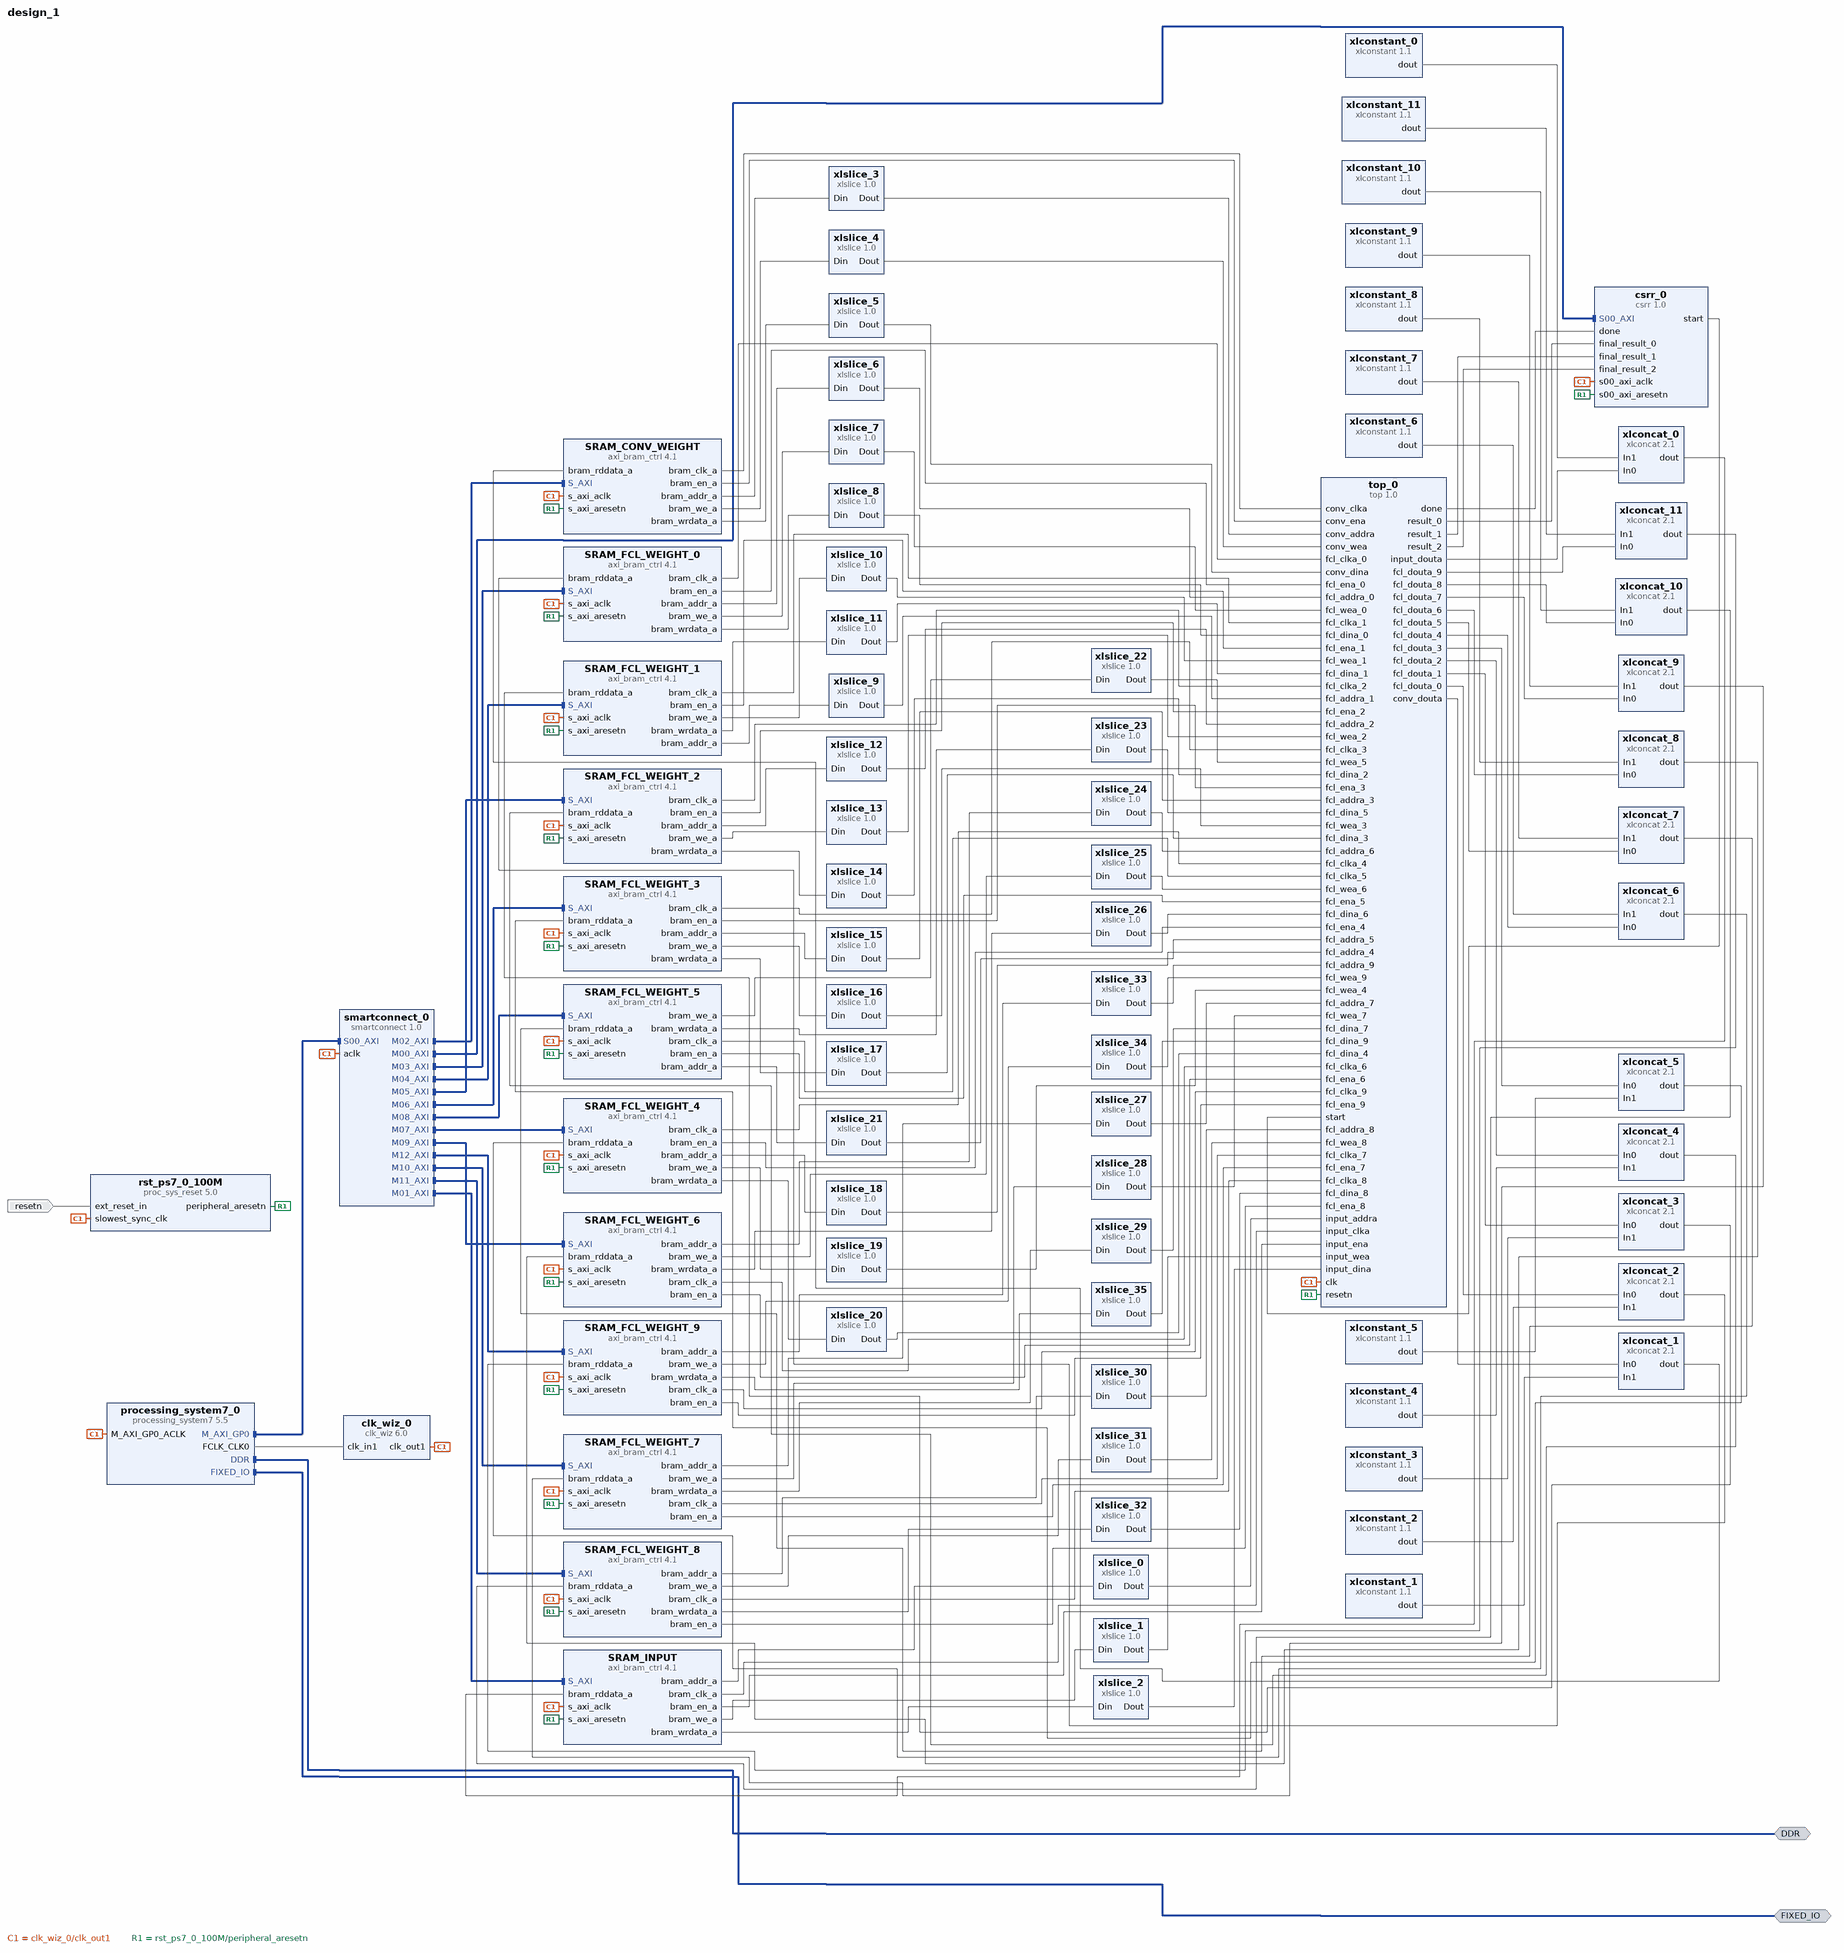
[diagram p0: block diagram of the top level]
# Vivado block design design_1, xc7z020clg400-1, Vivado 2021.1
create_bd_design design_1

create_bd_intf_port -mode Master -vlnv xilinx.com:interface:ddrx_rtl:1.0 DDR
create_bd_intf_port -mode Master -vlnv xilinx.com:display_processing_system7:fixedio_rtl:1.0 FIXED_IO
create_bd_port -dir I -type rst resetn

create_bd_cell -type ip -vlnv xilinx.com:ip:processing_system7:5.5 processing_system7_0
set_property -dict [list \
  CONFIG.PCW_APU_PERIPHERAL_FREQMHZ 650 \
  CONFIG.PCW_CRYSTAL_PERIPHERAL_FREQMHZ 50 \
  CONFIG.PCW_ENET0_ENET0_IO {MIO 16 .. 27} \
  CONFIG.PCW_ENET0_GRP_MDIO_ENABLE 1 \
  CONFIG.PCW_ENET0_GRP_MDIO_IO {MIO 52 .. 53} \
  CONFIG.PCW_ENET0_PERIPHERAL_ENABLE 1 \
  CONFIG.PCW_ENET0_RESET_ENABLE 1 \
  CONFIG.PCW_ENET0_RESET_IO {MIO 9} \
  CONFIG.PCW_ENET_RESET_ENABLE 1 \
  CONFIG.PCW_ENET_RESET_SELECT {Share reset pin} \
  CONFIG.PCW_FPGA0_PERIPHERAL_FREQMHZ 100 \
  CONFIG.PCW_FPGA1_PERIPHERAL_FREQMHZ 50 \
  CONFIG.PCW_GPIO_MIO_GPIO_ENABLE 1 \
  CONFIG.PCW_GPIO_MIO_GPIO_IO MIO \
  CONFIG.PCW_I2C_RESET_ENABLE 1 \
  CONFIG.PCW_M_AXI_GP0_FREQMHZ 10 \
  CONFIG.PCW_PERIPHERAL_BOARD_PRESET None \
  CONFIG.PCW_PRESET_BANK1_VOLTAGE {LVCMOS 1.8V} \
  CONFIG.PCW_QSPI_GRP_FBCLK_ENABLE 1 \
  CONFIG.PCW_QSPI_GRP_FBCLK_IO {MIO 8} \
  CONFIG.PCW_QSPI_GRP_SINGLE_SS_ENABLE 1 \
  CONFIG.PCW_QSPI_GRP_SINGLE_SS_IO {MIO 1 .. 6} \
  CONFIG.PCW_QSPI_PERIPHERAL_ENABLE 1 \
  CONFIG.PCW_QSPI_QSPI_IO {MIO 1 .. 6} \
  CONFIG.PCW_SD0_GRP_CD_ENABLE 1 \
  CONFIG.PCW_SD0_GRP_CD_IO {MIO 47} \
  CONFIG.PCW_SD0_GRP_WP_ENABLE 0 \
  CONFIG.PCW_SD0_PERIPHERAL_ENABLE 1 \
  CONFIG.PCW_SD0_SD0_IO {MIO 40 .. 45} \
  CONFIG.PCW_SDIO_PERIPHERAL_FREQMHZ 50 \
  CONFIG.PCW_SINGLE_QSPI_DATA_MODE x4 \
  CONFIG.PCW_UART0_PERIPHERAL_ENABLE 1 \
  CONFIG.PCW_UART0_UART0_IO {MIO 14 .. 15} \
  CONFIG.PCW_UART1_PERIPHERAL_ENABLE 0 \
  CONFIG.PCW_UART_PERIPHERAL_FREQMHZ 100 \
  CONFIG.PCW_UIPARAM_DDR_BUS_WIDTH {16 Bit} \
  CONFIG.PCW_UIPARAM_DDR_FREQ_MHZ 525 \
  CONFIG.PCW_UIPARAM_DDR_PARTNO {MT41J256M16 RE-125} \
  CONFIG.PCW_USB0_PERIPHERAL_ENABLE 1 \
  CONFIG.PCW_USB0_RESET_ENABLE 1 \
  CONFIG.PCW_USB0_RESET_IO {MIO 46} \
  CONFIG.PCW_USB0_USB0_IO {MIO 28 .. 39} \
  CONFIG.PCW_USB_RESET_ENABLE 1 \
  CONFIG.PCW_USB_RESET_SELECT {Share reset pin} \
] [get_bd_cells processing_system7_0]
# 481 more settings of processing_system7_0 are not shown: defaults, MIO pin electricals, DDR timing, and values the tool derives
create_bd_cell -type ip -vlnv xilinx.com:ip:axi_bram_ctrl:4.1 SRAM_INPUT
set_property -dict {CONFIG.SINGLE_PORT_BRAM 1} [get_bd_cells SRAM_INPUT]
create_bd_cell -type ip -vlnv xilinx.com:ip:axi_bram_ctrl:4.1 SRAM_CONV_WEIGHT
set_property -dict {CONFIG.SINGLE_PORT_BRAM 1} [get_bd_cells SRAM_CONV_WEIGHT]
create_bd_cell -type ip -vlnv xilinx.com:ip:axi_bram_ctrl:4.1 SRAM_FCL_WEIGHT_0
set_property -dict {CONFIG.SINGLE_PORT_BRAM 1} [get_bd_cells SRAM_FCL_WEIGHT_0]
create_bd_cell -type ip -vlnv xilinx.com:ip:xlslice:1.0 xlslice_0
set_property -dict {CONFIG.DIN_FROM 13 CONFIG.DIN_TO 2 CONFIG.DIN_WIDTH 14 CONFIG.DOUT_WIDTH 12} [get_bd_cells xlslice_0]
create_bd_cell -type ip -vlnv xilinx.com:ip:xlslice:1.0 xlslice_1
set_property -dict {CONFIG.DIN_WIDTH 4} [get_bd_cells xlslice_1]
create_bd_cell -type ip -vlnv xilinx.com:ip:xlslice:1.0 xlslice_2
set_property -dict {CONFIG.DIN_FROM 7 CONFIG.DOUT_WIDTH 8} [get_bd_cells xlslice_2]
create_bd_cell -type ip -vlnv xilinx.com:ip:xlslice:1.0 xlslice_3
set_property -dict {CONFIG.DIN_FROM 12 CONFIG.DIN_TO 2 CONFIG.DIN_WIDTH 13 CONFIG.DOUT_WIDTH 11} [get_bd_cells xlslice_3]
create_bd_cell -type ip -vlnv xilinx.com:ip:xlslice:1.0 xlslice_4
set_property -dict {CONFIG.DIN_WIDTH 4} [get_bd_cells xlslice_4]
create_bd_cell -type ip -vlnv xilinx.com:ip:xlslice:1.0 xlslice_5
set_property -dict {CONFIG.DIN_FROM 7 CONFIG.DOUT_WIDTH 8} [get_bd_cells xlslice_5]
create_bd_cell -type ip -vlnv xilinx.com:ip:xlslice:1.0 xlslice_6
set_property -dict {CONFIG.DIN_FROM 13 CONFIG.DIN_TO 2 CONFIG.DIN_WIDTH 14 CONFIG.DOUT_WIDTH 12} [get_bd_cells xlslice_6]
create_bd_cell -type ip -vlnv xilinx.com:ip:xlslice:1.0 xlslice_7
set_property -dict {CONFIG.DIN_WIDTH 4} [get_bd_cells xlslice_7]
create_bd_cell -type ip -vlnv xilinx.com:ip:xlslice:1.0 xlslice_8
set_property -dict {CONFIG.DIN_FROM 7 CONFIG.DOUT_WIDTH 8} [get_bd_cells xlslice_8]
create_bd_cell -type ip -vlnv xilinx.com:ip:axi_bram_ctrl:4.1 SRAM_FCL_WEIGHT_1
set_property -dict {CONFIG.SINGLE_PORT_BRAM 1} [get_bd_cells SRAM_FCL_WEIGHT_1]
create_bd_cell -type ip -vlnv xilinx.com:ip:xlslice:1.0 xlslice_9
set_property -dict {CONFIG.DIN_FROM 13 CONFIG.DIN_TO 2 CONFIG.DIN_WIDTH 14 CONFIG.DOUT_WIDTH 12} [get_bd_cells xlslice_9]
create_bd_cell -type ip -vlnv xilinx.com:ip:xlslice:1.0 xlslice_10
set_property -dict {CONFIG.DIN_WIDTH 4} [get_bd_cells xlslice_10]
create_bd_cell -type ip -vlnv xilinx.com:ip:xlslice:1.0 xlslice_11
set_property -dict {CONFIG.DIN_FROM 7 CONFIG.DOUT_WIDTH 8} [get_bd_cells xlslice_11]
create_bd_cell -type ip -vlnv xilinx.com:ip:axi_bram_ctrl:4.1 SRAM_FCL_WEIGHT_2
set_property -dict {CONFIG.SINGLE_PORT_BRAM 1} [get_bd_cells SRAM_FCL_WEIGHT_2]
create_bd_cell -type ip -vlnv xilinx.com:ip:xlslice:1.0 xlslice_12
set_property -dict {CONFIG.DIN_FROM 13 CONFIG.DIN_TO 2 CONFIG.DIN_WIDTH 14 CONFIG.DOUT_WIDTH 12} [get_bd_cells xlslice_12]
create_bd_cell -type ip -vlnv xilinx.com:ip:xlslice:1.0 xlslice_13
set_property -dict {CONFIG.DIN_WIDTH 4} [get_bd_cells xlslice_13]
create_bd_cell -type ip -vlnv xilinx.com:ip:xlslice:1.0 xlslice_14
set_property -dict {CONFIG.DIN_FROM 7 CONFIG.DOUT_WIDTH 8} [get_bd_cells xlslice_14]
create_bd_cell -type ip -vlnv xilinx.com:ip:axi_bram_ctrl:4.1 SRAM_FCL_WEIGHT_3
set_property -dict {CONFIG.SINGLE_PORT_BRAM 1} [get_bd_cells SRAM_FCL_WEIGHT_3]
create_bd_cell -type ip -vlnv xilinx.com:ip:xlslice:1.0 xlslice_15
set_property -dict {CONFIG.DIN_FROM 13 CONFIG.DIN_TO 2 CONFIG.DIN_WIDTH 14 CONFIG.DOUT_WIDTH 12} [get_bd_cells xlslice_15]
create_bd_cell -type ip -vlnv xilinx.com:ip:xlslice:1.0 xlslice_16
set_property -dict {CONFIG.DIN_WIDTH 4} [get_bd_cells xlslice_16]
create_bd_cell -type ip -vlnv xilinx.com:ip:xlslice:1.0 xlslice_17
set_property -dict {CONFIG.DIN_FROM 7 CONFIG.DOUT_WIDTH 8} [get_bd_cells xlslice_17]
create_bd_cell -type ip -vlnv xilinx.com:ip:axi_bram_ctrl:4.1 SRAM_FCL_WEIGHT_4
set_property -dict {CONFIG.SINGLE_PORT_BRAM 1} [get_bd_cells SRAM_FCL_WEIGHT_4]
create_bd_cell -type ip -vlnv xilinx.com:ip:xlslice:1.0 xlslice_18
set_property -dict {CONFIG.DIN_FROM 13 CONFIG.DIN_TO 2 CONFIG.DIN_WIDTH 14 CONFIG.DOUT_WIDTH 12} [get_bd_cells xlslice_18]
create_bd_cell -type ip -vlnv xilinx.com:ip:xlslice:1.0 xlslice_19
set_property -dict {CONFIG.DIN_WIDTH 4} [get_bd_cells xlslice_19]
create_bd_cell -type ip -vlnv xilinx.com:ip:xlslice:1.0 xlslice_20
set_property -dict {CONFIG.DIN_FROM 7 CONFIG.DOUT_WIDTH 8} [get_bd_cells xlslice_20]
create_bd_cell -type ip -vlnv xilinx.com:ip:axi_bram_ctrl:4.1 SRAM_FCL_WEIGHT_5
set_property -dict {CONFIG.SINGLE_PORT_BRAM 1} [get_bd_cells SRAM_FCL_WEIGHT_5]
create_bd_cell -type ip -vlnv xilinx.com:ip:xlslice:1.0 xlslice_21
set_property -dict {CONFIG.DIN_FROM 13 CONFIG.DIN_TO 2 CONFIG.DIN_WIDTH 14 CONFIG.DOUT_WIDTH 12} [get_bd_cells xlslice_21]
create_bd_cell -type ip -vlnv xilinx.com:ip:xlslice:1.0 xlslice_22
set_property -dict {CONFIG.DIN_WIDTH 4} [get_bd_cells xlslice_22]
create_bd_cell -type ip -vlnv xilinx.com:ip:xlslice:1.0 xlslice_23
set_property -dict {CONFIG.DIN_FROM 7 CONFIG.DOUT_WIDTH 8} [get_bd_cells xlslice_23]
create_bd_cell -type ip -vlnv xilinx.com:ip:axi_bram_ctrl:4.1 SRAM_FCL_WEIGHT_6
set_property -dict {CONFIG.SINGLE_PORT_BRAM 1} [get_bd_cells SRAM_FCL_WEIGHT_6]
create_bd_cell -type ip -vlnv xilinx.com:ip:xlslice:1.0 xlslice_24
set_property -dict {CONFIG.DIN_FROM 13 CONFIG.DIN_TO 2 CONFIG.DIN_WIDTH 14 CONFIG.DOUT_WIDTH 12} [get_bd_cells xlslice_24]
create_bd_cell -type ip -vlnv xilinx.com:ip:xlslice:1.0 xlslice_25
set_property -dict {CONFIG.DIN_WIDTH 4} [get_bd_cells xlslice_25]
create_bd_cell -type ip -vlnv xilinx.com:ip:xlslice:1.0 xlslice_26
set_property -dict {CONFIG.DIN_FROM 7 CONFIG.DOUT_WIDTH 8} [get_bd_cells xlslice_26]
create_bd_cell -type ip -vlnv xilinx.com:ip:axi_bram_ctrl:4.1 SRAM_FCL_WEIGHT_7
set_property -dict {CONFIG.SINGLE_PORT_BRAM 1} [get_bd_cells SRAM_FCL_WEIGHT_7]
create_bd_cell -type ip -vlnv xilinx.com:ip:xlslice:1.0 xlslice_27
set_property -dict {CONFIG.DIN_FROM 13 CONFIG.DIN_TO 2 CONFIG.DIN_WIDTH 14 CONFIG.DOUT_WIDTH 12} [get_bd_cells xlslice_27]
create_bd_cell -type ip -vlnv xilinx.com:ip:xlslice:1.0 xlslice_28
set_property -dict {CONFIG.DIN_WIDTH 4} [get_bd_cells xlslice_28]
create_bd_cell -type ip -vlnv xilinx.com:ip:xlslice:1.0 xlslice_29
set_property -dict {CONFIG.DIN_FROM 7 CONFIG.DOUT_WIDTH 8} [get_bd_cells xlslice_29]
create_bd_cell -type ip -vlnv xilinx.com:ip:axi_bram_ctrl:4.1 SRAM_FCL_WEIGHT_8
set_property -dict {CONFIG.SINGLE_PORT_BRAM 1} [get_bd_cells SRAM_FCL_WEIGHT_8]
create_bd_cell -type ip -vlnv xilinx.com:ip:xlslice:1.0 xlslice_30
set_property -dict {CONFIG.DIN_FROM 13 CONFIG.DIN_TO 2 CONFIG.DIN_WIDTH 14 CONFIG.DOUT_WIDTH 12} [get_bd_cells xlslice_30]
create_bd_cell -type ip -vlnv xilinx.com:ip:xlslice:1.0 xlslice_31
set_property -dict {CONFIG.DIN_WIDTH 4} [get_bd_cells xlslice_31]
create_bd_cell -type ip -vlnv xilinx.com:ip:xlslice:1.0 xlslice_32
set_property -dict {CONFIG.DIN_FROM 7 CONFIG.DOUT_WIDTH 8} [get_bd_cells xlslice_32]
create_bd_cell -type ip -vlnv xilinx.com:ip:axi_bram_ctrl:4.1 SRAM_FCL_WEIGHT_9
set_property -dict {CONFIG.SINGLE_PORT_BRAM 1} [get_bd_cells SRAM_FCL_WEIGHT_9]
create_bd_cell -type ip -vlnv xilinx.com:ip:xlslice:1.0 xlslice_33
set_property -dict {CONFIG.DIN_FROM 13 CONFIG.DIN_TO 2 CONFIG.DIN_WIDTH 14 CONFIG.DOUT_WIDTH 12} [get_bd_cells xlslice_33]
create_bd_cell -type ip -vlnv xilinx.com:ip:xlslice:1.0 xlslice_34
set_property -dict {CONFIG.DIN_WIDTH 4} [get_bd_cells xlslice_34]
create_bd_cell -type ip -vlnv xilinx.com:ip:xlslice:1.0 xlslice_35
set_property -dict {CONFIG.DIN_FROM 7 CONFIG.DOUT_WIDTH 8} [get_bd_cells xlslice_35]
create_bd_cell -type ip -vlnv xilinx.com:ip:xlconstant:1.1 xlconstant_0
set_property -dict {CONFIG.CONST_VAL 0 CONFIG.CONST_WIDTH 24} [get_bd_cells xlconstant_0]
create_bd_cell -type ip -vlnv xilinx.com:ip:xlconcat:2.1 xlconcat_0
set_property -dict {CONFIG.IN0_WIDTH 8 CONFIG.IN1_WIDTH 24} [get_bd_cells xlconcat_0]
create_bd_cell -type ip -vlnv xilinx.com:ip:xlconcat:2.1 xlconcat_1
set_property -dict {CONFIG.IN0_WIDTH 8 CONFIG.IN1_WIDTH 24} [get_bd_cells xlconcat_1]
create_bd_cell -type ip -vlnv xilinx.com:ip:xlconstant:1.1 xlconstant_1
set_property -dict {CONFIG.CONST_VAL 0 CONFIG.CONST_WIDTH 24} [get_bd_cells xlconstant_1]
create_bd_cell -type ip -vlnv xilinx.com:ip:xlconcat:2.1 xlconcat_2
set_property -dict {CONFIG.IN0_WIDTH 8 CONFIG.IN1_WIDTH 24} [get_bd_cells xlconcat_2]
create_bd_cell -type ip -vlnv xilinx.com:ip:xlconstant:1.1 xlconstant_2
set_property -dict {CONFIG.CONST_VAL 0 CONFIG.CONST_WIDTH 24} [get_bd_cells xlconstant_2]
create_bd_cell -type ip -vlnv xilinx.com:ip:xlconcat:2.1 xlconcat_3
set_property -dict {CONFIG.IN0_WIDTH 8 CONFIG.IN1_WIDTH 24} [get_bd_cells xlconcat_3]
create_bd_cell -type ip -vlnv xilinx.com:ip:xlconstant:1.1 xlconstant_3
set_property -dict {CONFIG.CONST_VAL 0 CONFIG.CONST_WIDTH 24} [get_bd_cells xlconstant_3]
create_bd_cell -type ip -vlnv xilinx.com:ip:xlconcat:2.1 xlconcat_4
set_property -dict {CONFIG.IN0_WIDTH 8 CONFIG.IN1_WIDTH 24} [get_bd_cells xlconcat_4]
create_bd_cell -type ip -vlnv xilinx.com:ip:xlconstant:1.1 xlconstant_4
set_property -dict {CONFIG.CONST_VAL 0 CONFIG.CONST_WIDTH 24} [get_bd_cells xlconstant_4]
create_bd_cell -type ip -vlnv xilinx.com:ip:xlconcat:2.1 xlconcat_5
set_property -dict {CONFIG.IN0_WIDTH 8 CONFIG.IN1_WIDTH 24} [get_bd_cells xlconcat_5]
create_bd_cell -type ip -vlnv xilinx.com:ip:xlconstant:1.1 xlconstant_5
set_property -dict {CONFIG.CONST_VAL 0 CONFIG.CONST_WIDTH 24} [get_bd_cells xlconstant_5]
create_bd_cell -type ip -vlnv xilinx.com:ip:xlconcat:2.1 xlconcat_6
set_property -dict {CONFIG.IN0_WIDTH 8 CONFIG.IN1_WIDTH 24} [get_bd_cells xlconcat_6]
create_bd_cell -type ip -vlnv xilinx.com:ip:xlconstant:1.1 xlconstant_6
set_property -dict {CONFIG.CONST_VAL 0 CONFIG.CONST_WIDTH 24} [get_bd_cells xlconstant_6]
create_bd_cell -type ip -vlnv xilinx.com:ip:xlconcat:2.1 xlconcat_7
set_property -dict {CONFIG.IN0_WIDTH 8 CONFIG.IN1_WIDTH 24} [get_bd_cells xlconcat_7]
create_bd_cell -type ip -vlnv xilinx.com:ip:xlconstant:1.1 xlconstant_7
set_property -dict {CONFIG.CONST_VAL 0 CONFIG.CONST_WIDTH 24} [get_bd_cells xlconstant_7]
create_bd_cell -type ip -vlnv xilinx.com:ip:xlconcat:2.1 xlconcat_8
set_property -dict {CONFIG.IN0_WIDTH 8 CONFIG.IN1_WIDTH 24} [get_bd_cells xlconcat_8]
create_bd_cell -type ip -vlnv xilinx.com:ip:xlconstant:1.1 xlconstant_8
set_property -dict {CONFIG.CONST_VAL 0 CONFIG.CONST_WIDTH 24} [get_bd_cells xlconstant_8]
create_bd_cell -type ip -vlnv xilinx.com:ip:xlconcat:2.1 xlconcat_9
set_property -dict {CONFIG.IN0_WIDTH 8 CONFIG.IN1_WIDTH 24} [get_bd_cells xlconcat_9]
create_bd_cell -type ip -vlnv xilinx.com:ip:xlconstant:1.1 xlconstant_9
set_property -dict {CONFIG.CONST_VAL 0 CONFIG.CONST_WIDTH 24} [get_bd_cells xlconstant_9]
create_bd_cell -type ip -vlnv xilinx.com:ip:xlconcat:2.1 xlconcat_10
set_property -dict {CONFIG.IN0_WIDTH 8 CONFIG.IN1_WIDTH 24} [get_bd_cells xlconcat_10]
create_bd_cell -type ip -vlnv xilinx.com:ip:xlconstant:1.1 xlconstant_10
set_property -dict {CONFIG.CONST_VAL 0 CONFIG.CONST_WIDTH 24} [get_bd_cells xlconstant_10]
create_bd_cell -type ip -vlnv xilinx.com:ip:xlconcat:2.1 xlconcat_11
set_property -dict {CONFIG.IN0_WIDTH 8 CONFIG.IN1_WIDTH 24} [get_bd_cells xlconcat_11]
create_bd_cell -type ip -vlnv xilinx.com:ip:xlconstant:1.1 xlconstant_11
set_property -dict {CONFIG.CONST_VAL 0 CONFIG.CONST_WIDTH 24} [get_bd_cells xlconstant_11]
create_bd_cell -type ip -vlnv xilinx.com:ip:smartconnect:1.0 smartconnect_0
set_property -dict {CONFIG.NUM_MI 13 CONFIG.NUM_SI 1} [get_bd_cells smartconnect_0]
create_bd_cell -type ip -vlnv xilinx.com:ip:proc_sys_reset:5.0 rst_ps7_0_100M
create_bd_cell -type ip -vlnv xilinx.com:user:csrr:1.0 csrr_0
create_bd_cell -type ip -vlnv xilinx.com:user:top:1.0 top_0
create_bd_cell -type ip -vlnv xilinx.com:ip:clk_wiz:6.0 clk_wiz_0
set_property -dict [list \
  CONFIG.CLKOUT1_JITTER 151.636 \
  CONFIG.CLKOUT1_REQUESTED_OUT_FREQ 50.000 \
  CONFIG.MMCM_CLKOUT0_DIVIDE_F 20.000 \
  CONFIG.USE_LOCKED false \
  CONFIG.USE_RESET false \
] [get_bd_cells clk_wiz_0]

# ---- connections ----

connect_bd_intf_net [get_bd_intf_ports DDR] [get_bd_intf_pins processing_system7_0/DDR]
connect_bd_intf_net [get_bd_intf_ports FIXED_IO] [get_bd_intf_pins processing_system7_0/FIXED_IO]
connect_bd_intf_net [get_bd_intf_pins processing_system7_0/M_AXI_GP0] [get_bd_intf_pins smartconnect_0/S00_AXI]
connect_bd_intf_net [get_bd_intf_pins csrr_0/S00_AXI] [get_bd_intf_pins smartconnect_0/M00_AXI]
connect_bd_intf_net [get_bd_intf_pins SRAM_INPUT/S_AXI] [get_bd_intf_pins smartconnect_0/M01_AXI]
connect_bd_intf_net [get_bd_intf_pins SRAM_CONV_WEIGHT/S_AXI] [get_bd_intf_pins smartconnect_0/M02_AXI]
connect_bd_intf_net [get_bd_intf_pins smartconnect_0/M03_AXI] [get_bd_intf_pins SRAM_FCL_WEIGHT_0/S_AXI]
connect_bd_intf_net [get_bd_intf_pins smartconnect_0/M04_AXI] [get_bd_intf_pins SRAM_FCL_WEIGHT_1/S_AXI]
connect_bd_intf_net [get_bd_intf_pins smartconnect_0/M05_AXI] [get_bd_intf_pins SRAM_FCL_WEIGHT_2/S_AXI]
connect_bd_intf_net [get_bd_intf_pins smartconnect_0/M06_AXI] [get_bd_intf_pins SRAM_FCL_WEIGHT_3/S_AXI]
connect_bd_intf_net [get_bd_intf_pins smartconnect_0/M07_AXI] [get_bd_intf_pins SRAM_FCL_WEIGHT_4/S_AXI]
connect_bd_intf_net [get_bd_intf_pins smartconnect_0/M08_AXI] [get_bd_intf_pins SRAM_FCL_WEIGHT_5/S_AXI]
connect_bd_intf_net [get_bd_intf_pins smartconnect_0/M09_AXI] [get_bd_intf_pins SRAM_FCL_WEIGHT_6/S_AXI]
connect_bd_intf_net [get_bd_intf_pins smartconnect_0/M10_AXI] [get_bd_intf_pins SRAM_FCL_WEIGHT_7/S_AXI]
connect_bd_intf_net [get_bd_intf_pins smartconnect_0/M11_AXI] [get_bd_intf_pins SRAM_FCL_WEIGHT_8/S_AXI]
connect_bd_intf_net [get_bd_intf_pins smartconnect_0/M12_AXI] [get_bd_intf_pins SRAM_FCL_WEIGHT_9/S_AXI]
connect_bd_net [get_bd_pins SRAM_CONV_WEIGHT/bram_addr_a] [get_bd_pins xlslice_3/Din]
connect_bd_net [get_bd_pins SRAM_CONV_WEIGHT/bram_clk_a] [get_bd_pins top_0/conv_clka]
connect_bd_net [get_bd_pins SRAM_CONV_WEIGHT/bram_en_a] [get_bd_pins top_0/conv_ena]
connect_bd_net [get_bd_pins SRAM_CONV_WEIGHT/bram_we_a] [get_bd_pins xlslice_4/Din]
connect_bd_net [get_bd_pins SRAM_CONV_WEIGHT/bram_wrdata_a] [get_bd_pins xlslice_5/Din]
connect_bd_net [get_bd_pins SRAM_FCL_WEIGHT_0/bram_addr_a] [get_bd_pins xlslice_6/Din]
connect_bd_net [get_bd_pins SRAM_FCL_WEIGHT_0/bram_clk_a] [get_bd_pins top_0/fcl_clka_0]
connect_bd_net [get_bd_pins SRAM_FCL_WEIGHT_0/bram_en_a] [get_bd_pins top_0/fcl_ena_0]
connect_bd_net [get_bd_pins SRAM_FCL_WEIGHT_0/bram_we_a] [get_bd_pins xlslice_7/Din]
connect_bd_net [get_bd_pins SRAM_FCL_WEIGHT_0/bram_wrdata_a] [get_bd_pins xlslice_8/Din]
connect_bd_net -net SRAM_FCL_WEIGHT_10_bram_addr_a [get_bd_pins SRAM_FCL_WEIGHT_9/bram_addr_a] [get_bd_pins xlslice_33/Din]
connect_bd_net -net SRAM_FCL_WEIGHT_10_bram_we_a [get_bd_pins SRAM_FCL_WEIGHT_9/bram_we_a] [get_bd_pins xlslice_34/Din]
connect_bd_net -net SRAM_FCL_WEIGHT_10_bram_wrdata_a [get_bd_pins SRAM_FCL_WEIGHT_9/bram_wrdata_a] [get_bd_pins xlslice_35/Din]
connect_bd_net [get_bd_pins SRAM_FCL_WEIGHT_1/bram_addr_a] [get_bd_pins xlslice_9/Din]
connect_bd_net [get_bd_pins SRAM_FCL_WEIGHT_1/bram_clk_a] [get_bd_pins top_0/fcl_clka_1]
connect_bd_net [get_bd_pins SRAM_FCL_WEIGHT_1/bram_en_a] [get_bd_pins top_0/fcl_ena_1]
connect_bd_net [get_bd_pins SRAM_FCL_WEIGHT_1/bram_we_a] [get_bd_pins xlslice_10/Din]
connect_bd_net [get_bd_pins SRAM_FCL_WEIGHT_1/bram_wrdata_a] [get_bd_pins xlslice_11/Din]
connect_bd_net [get_bd_pins SRAM_FCL_WEIGHT_2/bram_addr_a] [get_bd_pins xlslice_12/Din]
connect_bd_net [get_bd_pins SRAM_FCL_WEIGHT_2/bram_clk_a] [get_bd_pins top_0/fcl_clka_2]
connect_bd_net [get_bd_pins SRAM_FCL_WEIGHT_2/bram_en_a] [get_bd_pins top_0/fcl_ena_2]
connect_bd_net [get_bd_pins SRAM_FCL_WEIGHT_2/bram_we_a] [get_bd_pins xlslice_13/Din]
connect_bd_net [get_bd_pins SRAM_FCL_WEIGHT_2/bram_wrdata_a] [get_bd_pins xlslice_14/Din]
connect_bd_net [get_bd_pins SRAM_FCL_WEIGHT_3/bram_addr_a] [get_bd_pins xlslice_15/Din]
connect_bd_net [get_bd_pins SRAM_FCL_WEIGHT_3/bram_clk_a] [get_bd_pins top_0/fcl_clka_3]
connect_bd_net [get_bd_pins SRAM_FCL_WEIGHT_3/bram_en_a] [get_bd_pins top_0/fcl_ena_3]
connect_bd_net [get_bd_pins SRAM_FCL_WEIGHT_3/bram_we_a] [get_bd_pins xlslice_16/Din]
connect_bd_net [get_bd_pins SRAM_FCL_WEIGHT_3/bram_wrdata_a] [get_bd_pins xlslice_17/Din]
connect_bd_net [get_bd_pins SRAM_FCL_WEIGHT_4/bram_addr_a] [get_bd_pins xlslice_18/Din]
connect_bd_net [get_bd_pins SRAM_FCL_WEIGHT_4/bram_clk_a] [get_bd_pins top_0/fcl_clka_4]
connect_bd_net [get_bd_pins SRAM_FCL_WEIGHT_4/bram_en_a] [get_bd_pins top_0/fcl_ena_4]
connect_bd_net [get_bd_pins SRAM_FCL_WEIGHT_4/bram_we_a] [get_bd_pins xlslice_19/Din]
connect_bd_net [get_bd_pins SRAM_FCL_WEIGHT_4/bram_wrdata_a] [get_bd_pins xlslice_20/Din]
connect_bd_net [get_bd_pins SRAM_FCL_WEIGHT_5/bram_addr_a] [get_bd_pins xlslice_21/Din]
connect_bd_net [get_bd_pins SRAM_FCL_WEIGHT_5/bram_clk_a] [get_bd_pins top_0/fcl_clka_5]
connect_bd_net [get_bd_pins SRAM_FCL_WEIGHT_5/bram_en_a] [get_bd_pins top_0/fcl_ena_5]
connect_bd_net [get_bd_pins SRAM_FCL_WEIGHT_5/bram_we_a] [get_bd_pins xlslice_22/Din]
connect_bd_net [get_bd_pins SRAM_FCL_WEIGHT_5/bram_wrdata_a] [get_bd_pins xlslice_23/Din]
connect_bd_net [get_bd_pins SRAM_FCL_WEIGHT_6/bram_addr_a] [get_bd_pins xlslice_24/Din]
connect_bd_net [get_bd_pins SRAM_FCL_WEIGHT_6/bram_clk_a] [get_bd_pins top_0/fcl_clka_6]
connect_bd_net [get_bd_pins SRAM_FCL_WEIGHT_6/bram_en_a] [get_bd_pins top_0/fcl_ena_6]
connect_bd_net [get_bd_pins SRAM_FCL_WEIGHT_6/bram_we_a] [get_bd_pins xlslice_25/Din]
connect_bd_net [get_bd_pins SRAM_FCL_WEIGHT_6/bram_wrdata_a] [get_bd_pins xlslice_26/Din]
connect_bd_net [get_bd_pins SRAM_FCL_WEIGHT_7/bram_clk_a] [get_bd_pins top_0/fcl_clka_7]
connect_bd_net [get_bd_pins SRAM_FCL_WEIGHT_7/bram_en_a] [get_bd_pins top_0/fcl_ena_7]
connect_bd_net -net SRAM_FCL_WEIGHT_8_bram_addr_a [get_bd_pins SRAM_FCL_WEIGHT_7/bram_addr_a] [get_bd_pins xlslice_27/Din]
connect_bd_net [get_bd_pins SRAM_FCL_WEIGHT_8/bram_clk_a] [get_bd_pins top_0/fcl_clka_8]
connect_bd_net [get_bd_pins SRAM_FCL_WEIGHT_8/bram_en_a] [get_bd_pins top_0/fcl_ena_8]
connect_bd_net -net SRAM_FCL_WEIGHT_8_bram_we_a [get_bd_pins SRAM_FCL_WEIGHT_7/bram_we_a] [get_bd_pins xlslice_28/Din]
connect_bd_net -net SRAM_FCL_WEIGHT_8_bram_wrdata_a [get_bd_pins SRAM_FCL_WEIGHT_7/bram_wrdata_a] [get_bd_pins xlslice_29/Din]
connect_bd_net -net SRAM_FCL_WEIGHT_9_bram_addr_a [get_bd_pins SRAM_FCL_WEIGHT_8/bram_addr_a] [get_bd_pins xlslice_30/Din]
connect_bd_net [get_bd_pins SRAM_FCL_WEIGHT_9/bram_clk_a] [get_bd_pins top_0/fcl_clka_9]
connect_bd_net [get_bd_pins SRAM_FCL_WEIGHT_9/bram_en_a] [get_bd_pins top_0/fcl_ena_9]
connect_bd_net -net SRAM_FCL_WEIGHT_9_bram_we_a [get_bd_pins SRAM_FCL_WEIGHT_8/bram_we_a] [get_bd_pins xlslice_31/Din]
connect_bd_net -net SRAM_FCL_WEIGHT_9_bram_wrdata_a [get_bd_pins SRAM_FCL_WEIGHT_8/bram_wrdata_a] [get_bd_pins xlslice_32/Din]
connect_bd_net [get_bd_pins SRAM_INPUT/bram_addr_a] [get_bd_pins xlslice_0/Din]
connect_bd_net [get_bd_pins SRAM_INPUT/bram_clk_a] [get_bd_pins top_0/input_clka]
connect_bd_net [get_bd_pins SRAM_INPUT/bram_en_a] [get_bd_pins top_0/input_ena]
connect_bd_net [get_bd_pins SRAM_INPUT/bram_we_a] [get_bd_pins xlslice_1/Din]
connect_bd_net [get_bd_pins SRAM_INPUT/bram_wrdata_a] [get_bd_pins xlslice_2/Din]
connect_bd_net [get_bd_pins clk_wiz_0/clk_out1] \
  [get_bd_pins rst_ps7_0_100M/slowest_sync_clk] [get_bd_pins SRAM_FCL_WEIGHT_1/s_axi_aclk] \
  [get_bd_pins SRAM_INPUT/s_axi_aclk] [get_bd_pins SRAM_CONV_WEIGHT/s_axi_aclk] [get_bd_pins SRAM_FCL_WEIGHT_0/s_axi_aclk] \
  [get_bd_pins SRAM_FCL_WEIGHT_2/s_axi_aclk] [get_bd_pins SRAM_FCL_WEIGHT_3/s_axi_aclk] \
  [get_bd_pins SRAM_FCL_WEIGHT_4/s_axi_aclk] [get_bd_pins SRAM_FCL_WEIGHT_5/s_axi_aclk] \
  [get_bd_pins SRAM_FCL_WEIGHT_6/s_axi_aclk] [get_bd_pins SRAM_FCL_WEIGHT_7/s_axi_aclk] \
  [get_bd_pins SRAM_FCL_WEIGHT_8/s_axi_aclk] [get_bd_pins SRAM_FCL_WEIGHT_9/s_axi_aclk] \
  [get_bd_pins processing_system7_0/M_AXI_GP0_ACLK] [get_bd_pins csrr_0/s00_axi_aclk] [get_bd_pins top_0/clk] \
  [get_bd_pins smartconnect_0/aclk]
connect_bd_net [get_bd_pins csrr_0/start] [get_bd_pins top_0/start]
connect_bd_net [get_bd_pins processing_system7_0/FCLK_CLK0] [get_bd_pins clk_wiz_0/clk_in1]
connect_bd_net [get_bd_ports resetn] [get_bd_pins rst_ps7_0_100M/ext_reset_in]
connect_bd_net [get_bd_pins rst_ps7_0_100M/peripheral_aresetn] \
  [get_bd_pins SRAM_CONV_WEIGHT/s_axi_aresetn] [get_bd_pins SRAM_FCL_WEIGHT_0/s_axi_aresetn] \
  [get_bd_pins SRAM_FCL_WEIGHT_1/s_axi_aresetn] [get_bd_pins SRAM_FCL_WEIGHT_2/s_axi_aresetn] \
  [get_bd_pins SRAM_FCL_WEIGHT_3/s_axi_aresetn] [get_bd_pins SRAM_FCL_WEIGHT_4/s_axi_aresetn] \
  [get_bd_pins SRAM_FCL_WEIGHT_5/s_axi_aresetn] [get_bd_pins SRAM_FCL_WEIGHT_6/s_axi_aresetn] \
  [get_bd_pins SRAM_FCL_WEIGHT_7/s_axi_aresetn] [get_bd_pins SRAM_FCL_WEIGHT_8/s_axi_aresetn] \
  [get_bd_pins SRAM_FCL_WEIGHT_9/s_axi_aresetn] [get_bd_pins SRAM_INPUT/s_axi_aresetn] [get_bd_pins csrr_0/s00_axi_aresetn] \
  [get_bd_pins top_0/resetn]
connect_bd_net [get_bd_pins top_0/conv_douta] [get_bd_pins xlconcat_1/In0]
connect_bd_net [get_bd_pins top_0/done] [get_bd_pins csrr_0/done]
connect_bd_net [get_bd_pins top_0/fcl_douta_0] [get_bd_pins xlconcat_2/In0]
connect_bd_net [get_bd_pins top_0/fcl_douta_1] [get_bd_pins xlconcat_3/In0]
connect_bd_net [get_bd_pins top_0/fcl_douta_2] [get_bd_pins xlconcat_4/In0]
connect_bd_net [get_bd_pins top_0/fcl_douta_3] [get_bd_pins xlconcat_5/In0]
connect_bd_net [get_bd_pins top_0/fcl_douta_4] [get_bd_pins xlconcat_6/In0]
connect_bd_net [get_bd_pins top_0/fcl_douta_5] [get_bd_pins xlconcat_7/In0]
connect_bd_net [get_bd_pins top_0/fcl_douta_6] [get_bd_pins xlconcat_8/In0]
connect_bd_net [get_bd_pins top_0/fcl_douta_7] [get_bd_pins xlconcat_9/In0]
connect_bd_net [get_bd_pins top_0/fcl_douta_8] [get_bd_pins xlconcat_10/In0]
connect_bd_net [get_bd_pins top_0/fcl_douta_9] [get_bd_pins xlconcat_11/In0]
connect_bd_net [get_bd_pins top_0/input_douta] [get_bd_pins xlconcat_0/In0]
connect_bd_net [get_bd_pins top_0/result_0] [get_bd_pins csrr_0/final_result_0]
connect_bd_net [get_bd_pins top_0/result_1] [get_bd_pins csrr_0/final_result_1]
connect_bd_net [get_bd_pins top_0/result_2] [get_bd_pins csrr_0/final_result_2]
connect_bd_net [get_bd_pins xlconcat_0/dout] [get_bd_pins SRAM_INPUT/bram_rddata_a]
connect_bd_net [get_bd_pins xlconcat_10/dout] [get_bd_pins SRAM_FCL_WEIGHT_8/bram_rddata_a]
connect_bd_net [get_bd_pins xlconcat_11/dout] [get_bd_pins SRAM_FCL_WEIGHT_9/bram_rddata_a]
connect_bd_net [get_bd_pins xlconcat_1/dout] [get_bd_pins SRAM_CONV_WEIGHT/bram_rddata_a]
connect_bd_net [get_bd_pins xlconcat_2/dout] [get_bd_pins SRAM_FCL_WEIGHT_0/bram_rddata_a]
connect_bd_net [get_bd_pins xlconcat_3/dout] [get_bd_pins SRAM_FCL_WEIGHT_1/bram_rddata_a]
connect_bd_net [get_bd_pins xlconcat_4/dout] [get_bd_pins SRAM_FCL_WEIGHT_2/bram_rddata_a]
connect_bd_net [get_bd_pins xlconcat_5/dout] [get_bd_pins SRAM_FCL_WEIGHT_3/bram_rddata_a]
connect_bd_net [get_bd_pins xlconcat_6/dout] [get_bd_pins SRAM_FCL_WEIGHT_4/bram_rddata_a]
connect_bd_net [get_bd_pins xlconcat_7/dout] [get_bd_pins SRAM_FCL_WEIGHT_5/bram_rddata_a]
connect_bd_net [get_bd_pins xlconcat_8/dout] [get_bd_pins SRAM_FCL_WEIGHT_6/bram_rddata_a]
connect_bd_net [get_bd_pins xlconcat_9/dout] [get_bd_pins SRAM_FCL_WEIGHT_7/bram_rddata_a]
connect_bd_net [get_bd_pins xlconstant_0/dout] [get_bd_pins xlconcat_0/In1]
connect_bd_net [get_bd_pins xlconstant_10/dout] [get_bd_pins xlconcat_10/In1]
connect_bd_net [get_bd_pins xlconstant_11/dout] [get_bd_pins xlconcat_11/In1]
connect_bd_net [get_bd_pins xlconstant_1/dout] [get_bd_pins xlconcat_1/In1]
connect_bd_net [get_bd_pins xlconstant_2/dout] [get_bd_pins xlconcat_2/In1]
connect_bd_net [get_bd_pins xlconstant_3/dout] [get_bd_pins xlconcat_3/In1]
connect_bd_net [get_bd_pins xlconstant_4/dout] [get_bd_pins xlconcat_4/In1]
connect_bd_net [get_bd_pins xlconstant_5/dout] [get_bd_pins xlconcat_5/In1]
connect_bd_net [get_bd_pins xlconstant_6/dout] [get_bd_pins xlconcat_6/In1]
connect_bd_net [get_bd_pins xlconstant_7/dout] [get_bd_pins xlconcat_7/In1]
connect_bd_net [get_bd_pins xlconstant_8/dout] [get_bd_pins xlconcat_8/In1]
connect_bd_net [get_bd_pins xlconstant_9/dout] [get_bd_pins xlconcat_9/In1]
connect_bd_net [get_bd_pins xlslice_0/Dout] [get_bd_pins top_0/input_addra]
connect_bd_net [get_bd_pins xlslice_10/Dout] [get_bd_pins top_0/fcl_wea_1]
connect_bd_net [get_bd_pins xlslice_11/Dout] [get_bd_pins top_0/fcl_dina_1]
connect_bd_net [get_bd_pins xlslice_12/Dout] [get_bd_pins top_0/fcl_addra_2]
connect_bd_net [get_bd_pins xlslice_13/Dout] [get_bd_pins top_0/fcl_wea_2]
connect_bd_net [get_bd_pins xlslice_14/Dout] [get_bd_pins top_0/fcl_dina_2]
connect_bd_net [get_bd_pins xlslice_15/Dout] [get_bd_pins top_0/fcl_addra_3]
connect_bd_net [get_bd_pins xlslice_16/Dout] [get_bd_pins top_0/fcl_wea_3]
connect_bd_net [get_bd_pins xlslice_17/Dout] [get_bd_pins top_0/fcl_dina_3]
connect_bd_net [get_bd_pins xlslice_18/Dout] [get_bd_pins top_0/fcl_addra_4]
connect_bd_net [get_bd_pins xlslice_19/Dout] [get_bd_pins top_0/fcl_wea_4]
connect_bd_net [get_bd_pins xlslice_1/Dout] [get_bd_pins top_0/input_wea]
connect_bd_net [get_bd_pins xlslice_20/Dout] [get_bd_pins top_0/fcl_dina_4]
connect_bd_net [get_bd_pins xlslice_21/Dout] [get_bd_pins top_0/fcl_addra_5]
connect_bd_net [get_bd_pins xlslice_22/Dout] [get_bd_pins top_0/fcl_wea_5]
connect_bd_net [get_bd_pins xlslice_23/Dout] [get_bd_pins top_0/fcl_dina_5]
connect_bd_net [get_bd_pins xlslice_24/Dout] [get_bd_pins top_0/fcl_addra_6]
connect_bd_net [get_bd_pins xlslice_25/Dout] [get_bd_pins top_0/fcl_wea_6]
connect_bd_net [get_bd_pins xlslice_26/Dout] [get_bd_pins top_0/fcl_dina_6]
connect_bd_net [get_bd_pins xlslice_27/Dout] [get_bd_pins top_0/fcl_addra_7]
connect_bd_net [get_bd_pins xlslice_28/Dout] [get_bd_pins top_0/fcl_wea_7]
connect_bd_net [get_bd_pins xlslice_29/Dout] [get_bd_pins top_0/fcl_dina_7]
connect_bd_net [get_bd_pins xlslice_2/Dout] [get_bd_pins top_0/input_dina]
connect_bd_net [get_bd_pins xlslice_30/Dout] [get_bd_pins top_0/fcl_addra_8]
connect_bd_net [get_bd_pins xlslice_31/Dout] [get_bd_pins top_0/fcl_wea_8]
connect_bd_net [get_bd_pins xlslice_32/Dout] [get_bd_pins top_0/fcl_dina_8]
connect_bd_net [get_bd_pins xlslice_33/Dout] [get_bd_pins top_0/fcl_addra_9]
connect_bd_net [get_bd_pins xlslice_34/Dout] [get_bd_pins top_0/fcl_wea_9]
connect_bd_net [get_bd_pins xlslice_35/Dout] [get_bd_pins top_0/fcl_dina_9]
connect_bd_net [get_bd_pins xlslice_3/Dout] [get_bd_pins top_0/conv_addra]
connect_bd_net [get_bd_pins xlslice_4/Dout] [get_bd_pins top_0/conv_wea]
connect_bd_net [get_bd_pins xlslice_5/Dout] [get_bd_pins top_0/conv_dina]
connect_bd_net [get_bd_pins xlslice_6/Dout] [get_bd_pins top_0/fcl_addra_0]
connect_bd_net [get_bd_pins xlslice_7/Dout] [get_bd_pins top_0/fcl_wea_0]
connect_bd_net [get_bd_pins xlslice_8/Dout] [get_bd_pins top_0/fcl_dina_0]
connect_bd_net [get_bd_pins xlslice_9/Dout] [get_bd_pins top_0/fcl_addra_1]

# ---- address map ----
assign_bd_address -offset 0x40000000 -range 8K -target_address_space [get_bd_addr_spaces processing_system7_0/Data] [get_bd_addr_segs SRAM_CONV_WEIGHT/S_AXI/Mem0]
assign_bd_address -offset 0x42000000 -range 16K -target_address_space [get_bd_addr_spaces processing_system7_0/Data] [get_bd_addr_segs SRAM_FCL_WEIGHT_0/S_AXI/Mem0]
assign_bd_address -offset 0x43C00000 -range 256 -target_address_space [get_bd_addr_spaces processing_system7_0/Data] [get_bd_addr_segs csrr_0/S00_AXI/S00_AXI_reg]
assign_bd_address -offset 0x44000000 -range 16K -target_address_space [get_bd_addr_spaces processing_system7_0/Data] [get_bd_addr_segs SRAM_FCL_WEIGHT_1/S_AXI/Mem0]
assign_bd_address -offset 0x46000000 -range 16K -target_address_space [get_bd_addr_spaces processing_system7_0/Data] [get_bd_addr_segs SRAM_FCL_WEIGHT_2/S_AXI/Mem0]
assign_bd_address -offset 0x48000000 -range 16K -target_address_space [get_bd_addr_spaces processing_system7_0/Data] [get_bd_addr_segs SRAM_FCL_WEIGHT_3/S_AXI/Mem0]
assign_bd_address -offset 0x4A000000 -range 16K -target_address_space [get_bd_addr_spaces processing_system7_0/Data] [get_bd_addr_segs SRAM_FCL_WEIGHT_4/S_AXI/Mem0]
assign_bd_address -offset 0x4C000000 -range 16K -target_address_space [get_bd_addr_spaces processing_system7_0/Data] [get_bd_addr_segs SRAM_FCL_WEIGHT_5/S_AXI/Mem0]
assign_bd_address -offset 0x4E000000 -range 16K -target_address_space [get_bd_addr_spaces processing_system7_0/Data] [get_bd_addr_segs SRAM_FCL_WEIGHT_6/S_AXI/Mem0]
assign_bd_address -offset 0x50000000 -range 16K -target_address_space [get_bd_addr_spaces processing_system7_0/Data] [get_bd_addr_segs SRAM_FCL_WEIGHT_7/S_AXI/Mem0]
assign_bd_address -offset 0x52000000 -range 16K -target_address_space [get_bd_addr_spaces processing_system7_0/Data] [get_bd_addr_segs SRAM_FCL_WEIGHT_8/S_AXI/Mem0]
assign_bd_address -offset 0x54000000 -range 16K -target_address_space [get_bd_addr_spaces processing_system7_0/Data] [get_bd_addr_segs SRAM_FCL_WEIGHT_9/S_AXI/Mem0]
assign_bd_address -offset 0x56000000 -range 16K -target_address_space [get_bd_addr_spaces processing_system7_0/Data] [get_bd_addr_segs SRAM_INPUT/S_AXI/Mem0]

validate_bd_design
save_bd_design
